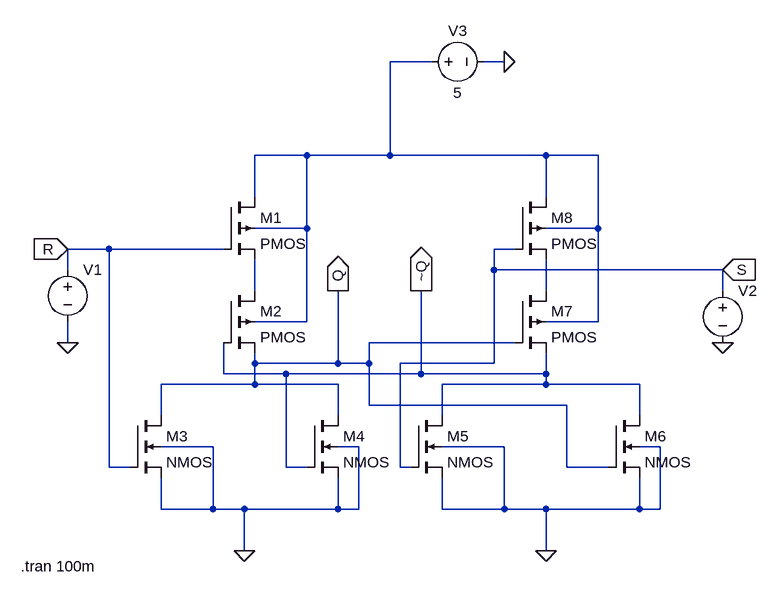
[diagram p0: schematic SR_Latch.asc]
SR_Latch.asc, the LTspice schematic file:
Version 4.1
SHEET 1 1220 680
WIRE 432 -176 368 -176
WIRE 544 -176 512 -176
WIRE 240 -32 160 -32
WIRE 368 -32 368 -176
WIRE 368 -32 240 -32
WIRE 608 -32 368 -32
WIRE 688 -32 608 -32
WIRE 160 32 160 -32
WIRE 608 32 608 -32
WIRE 240 80 240 -32
WIRE 240 80 160 80
WIRE 688 80 688 -32
WIRE 688 80 608 80
WIRE -64 112 -128 112
WIRE 112 112 -64 112
WIRE 560 112 528 112
WIRE -128 144 -128 112
WIRE 528 144 528 112
WIRE 880 144 528 144
WIRE 160 176 160 128
WIRE 608 176 608 128
WIRE 880 176 880 144
WIRE 240 224 240 80
WIRE 240 224 160 224
WIRE 688 224 688 80
WIRE 688 224 608 224
WIRE -128 256 -128 224
WIRE 560 256 336 256
WIRE 160 288 160 272
WIRE 288 288 288 176
WIRE 288 288 160 288
WIRE 336 288 336 256
WIRE 336 288 288 288
WIRE 528 288 528 144
WIRE 528 288 384 288
WIRE 112 304 112 256
WIRE 208 304 112 304
WIRE 416 304 416 176
WIRE 416 304 208 304
WIRE 608 304 608 272
WIRE 608 304 416 304
WIRE 160 320 160 288
WIRE 160 320 16 320
WIRE 288 320 160 320
WIRE 608 320 608 304
WIRE 608 320 448 320
WIRE 752 320 608 320
WIRE 336 352 336 288
WIRE 640 352 336 352
WIRE 16 368 16 320
WIRE 288 368 288 320
WIRE 448 368 448 320
WIRE 752 368 752 320
WIRE 96 416 16 416
WIRE 320 416 288 416
WIRE 544 416 448 416
WIRE 784 416 752 416
WIRE -64 448 -64 112
WIRE -32 448 -64 448
WIRE 208 448 208 304
WIRE 240 448 208 448
WIRE 384 448 384 288
WIRE 400 448 384 448
WIRE 640 448 640 352
WIRE 704 448 640 448
WIRE 16 512 16 464
WIRE 96 512 96 416
WIRE 96 512 16 512
WIRE 144 512 96 512
WIRE 288 512 288 464
WIRE 288 512 144 512
WIRE 320 512 320 416
WIRE 320 512 288 512
WIRE 448 512 448 464
WIRE 544 512 544 416
WIRE 544 512 448 512
WIRE 608 512 544 512
WIRE 752 512 752 464
WIRE 752 512 608 512
WIRE 784 512 784 416
WIRE 784 512 752 512
WIRE 144 576 144 512
WIRE 608 576 608 512
FLAG 144 576 0
FLAG 608 576 0
FLAG 544 -176 0
FLAG -128 256 0
FLAG 880 256 0
FLAG -128 112 R
IOPIN -128 112 In
FLAG 880 144 S
IOPIN 880 144 In
FLAG 288 176 Q
IOPIN 288 176 Out
FLAG 416 176 ~Q
IOPIN 416 176 Out
SYMBOL voltage 880 160 R0
WINDOW 3 24 96 Invisible 2
WINDOW 123 0 0 Left 0
WINDOW 39 0 0 Left 0
SYMATTR InstName V2
SYMATTR Value PULSE(0 5 0 1n 1n 20m 40m)
SYMBOL voltage 416 -176 R270
WINDOW 0 32 56 VTop 2
WINDOW 3 -32 56 VBottom 2
WINDOW 123 0 0 Left 0
WINDOW 39 0 0 Left 0
SYMATTR InstName V3
SYMATTR Value 5
SYMBOL pmos4 112 32 R0
SYMATTR InstName M1
SYMBOL pmos4 560 32 R0
SYMATTR InstName M8
SYMBOL pmos4 112 176 R0
SYMATTR InstName M2
SYMBOL pmos4 560 176 R0
SYMATTR InstName M7
SYMBOL nmos4 -32 368 R0
SYMATTR InstName M3
SYMBOL nmos4 240 368 R0
SYMATTR InstName M4
SYMBOL nmos4 400 368 R0
SYMATTR InstName M5
SYMBOL nmos4 704 368 R0
SYMATTR InstName M6
SYMBOL voltage -128 128 R0
WINDOW 3 24 96 Invisible 2
WINDOW 123 0 0 Left 0
WINDOW 39 0 0 Left 0
SYMATTR InstName V1
SYMATTR Value PULSE(0 5 0 1n 1n 10m 20m)
TEXT -200 600 Left 2 !.tran 100m

The netlist it stands for:
* SR_Latch.asc
V2 S 0 PULSE(0 5 0 1n 1n 20m 40m)
V3 N001 0 5
M1 N001 R N002 N001 PMOS
M8 N001 S N003 N001 PMOS
M2 N002 ~Q Q N001 PMOS
M7 N003 Q ~Q N001 PMOS
M3 Q R 0 0 NMOS
M4 Q ~Q 0 0 NMOS
M5 ~Q S 0 0 NMOS
M6 ~Q Q 0 0 NMOS
V1 R 0 PULSE(0 5 0 1n 1n 10m 20m)
.model NMOS NMOS
.model PMOS PMOS
.lib standard.mos
.tran 100m
.backanno
.end